# EAGLE design h-bridge (EAGLE 4.16)
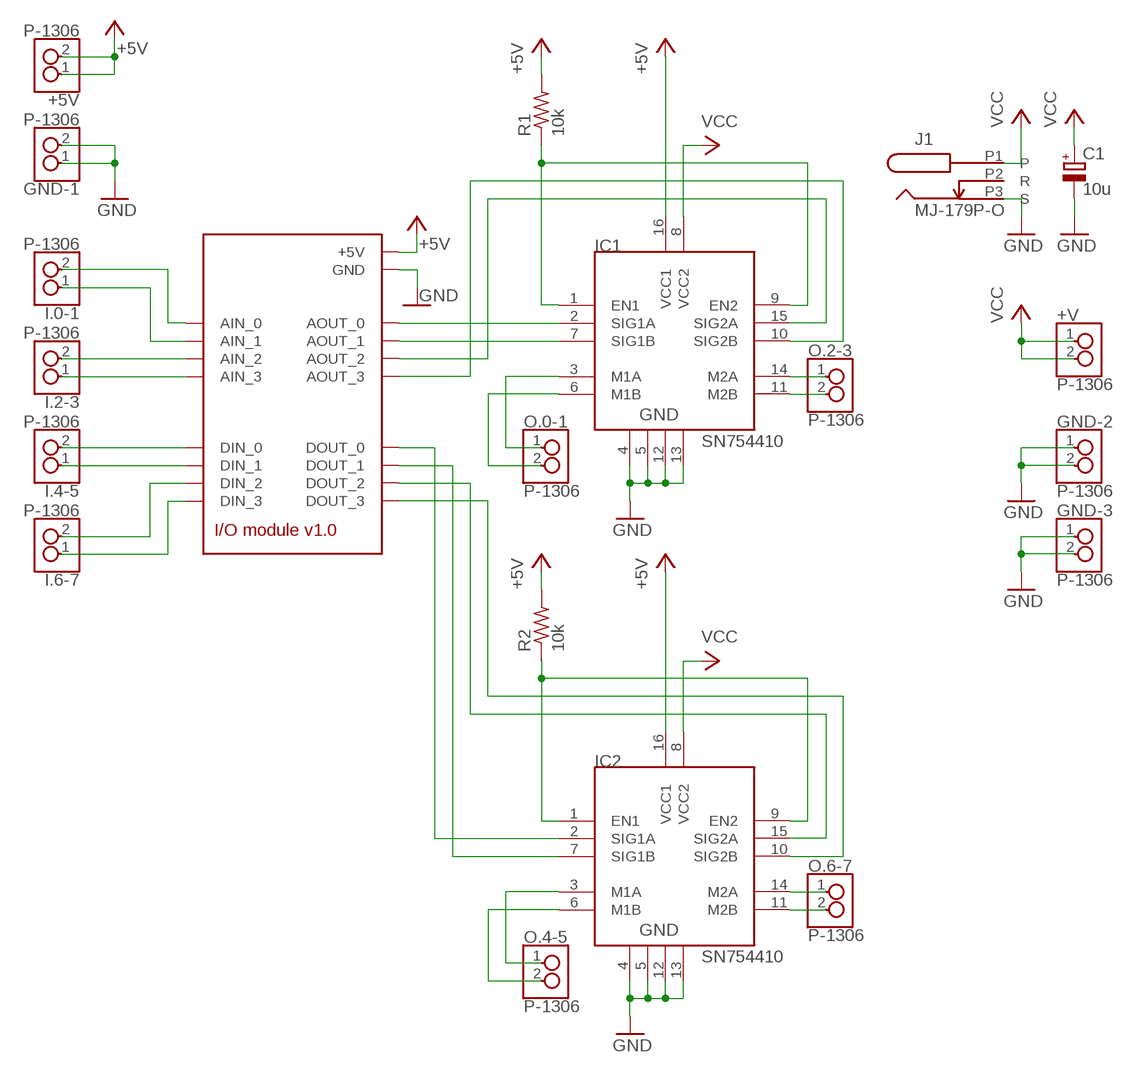
[diagram p0: schematic, sheet 1]

## Parts
+5V  P-1306  [P-1306]
+V  P-1306  [P-1306]
C1  10u  CPOL-EUE2.5-5  [E2,5-5]
GND-1  P-1306  [P-1306]
GND-2  P-1306  [P-1306]
GND-3  P-1306  [P-1306]
I.0-1  P-1306  [P-1306]
I.2-3  P-1306  [P-1306]
I.4-5  P-1306  [P-1306]
I.6-7  P-1306  [P-1306]
IC1  SN754410  [DIP16]
IC2  SN754410  [DIP16]
J1  MJ-179P-O  [MJ-179P-OLIMEX]
MODULE1  I/O_MODULE_V1.0  [I/O_MODULE_V1.0]
O.0-1  P-1306  [P-1306]
O.2-3  P-1306  [P-1306]
O.4-5  P-1306  [P-1306]
O.6-7  P-1306  [P-1306]
R1  10k  R-US_0204/5  [0204/5]
R2  10k  R-US_0204/5  [0204/5]

## Nets
+5V: +5V.1 +5V.2 IC1.16(VCC1) IC2.16(VCC1) MODULE1.+5V R1.2 R2.2
GND: C1.- GND-1.1 GND-1.2 GND-2.1 GND-2.2 GND-3.1 GND-3.2 IC1.4 IC1.5 IC1.12 IC1.13 IC2.4 IC2.5 IC2.12 IC2.13 J1.P3(S) MODULE1.GND
N$1: IC1.2(SIG1A) MODULE1.AOUT_0
N$2: IC1.7(SIG1B) MODULE1.AOUT_1
N$3: IC1.15(SIG2A) MODULE1.AOUT_2
N$4: IC1.10(SIG2B) MODULE1.AOUT_3
N$5: IC1.1(EN1) IC1.9(EN2) R1.1
N$6: I.0-1.2 MODULE1.AIN_0
N$7: IC2.2(SIG1A) MODULE1.DOUT_0
N$8: IC2.7(SIG1B) MODULE1.DOUT_1
N$9: IC2.15(SIG2A) MODULE1.DOUT_2
N$10: IC2.10(SIG2B) MODULE1.DOUT_3
N$11: IC2.1(EN1) IC2.9(EN2) R2.1
N$12: I.0-1.1 MODULE1.AIN_1
N$13: IC1.3(M1A) O.0-1.1
N$14: IC1.6(M1B) O.0-1.2
N$15: I.2-3.2 MODULE1.AIN_2
N$16: IC1.11(M2B) O.2-3.2
N$17: IC2.14(M2A) O.6-7.1
N$18: IC2.11(M2B) O.6-7.2
N$19: IC2.3(M1A) O.4-5.1
N$20: IC2.6(M1B) O.4-5.2
N$21: I.2-3.1 MODULE1.AIN_3
N$22: I.4-5.2 MODULE1.DIN_0
N$23: I.4-5.1 MODULE1.DIN_1
N$24: I.6-7.2 MODULE1.DIN_2
N$25: I.6-7.1 MODULE1.DIN_3
O.2-3: IC1.14(M2A) O.2-3.1
VCC: +V.1 +V.2 C1.+ IC1.8(VCC2) IC2.8(VCC2) J1.P1(P)
Unconnected: J1.P2(R)

## Library data of the parts
+5V +V GND-1-GND-3 I.0-1 I.2-3 I.4-5 I.6-7 O.0-1 O.2-3 O.4-5 O.6-7 = akizuki_terminal-block:P-1306
C1 = rcl:CPOL-EU: POLARIZED CAPACITOR, European symbol
IC1 IC2 = HBridge:SN754410: Quadruple half-H driver
J1 = marushin:MJ-179P-
MODULE1 = gainer:I/O_MODULE_V1.0
R1 R2 = rcl:R-US_: RESISTOR, American symbol

## Board
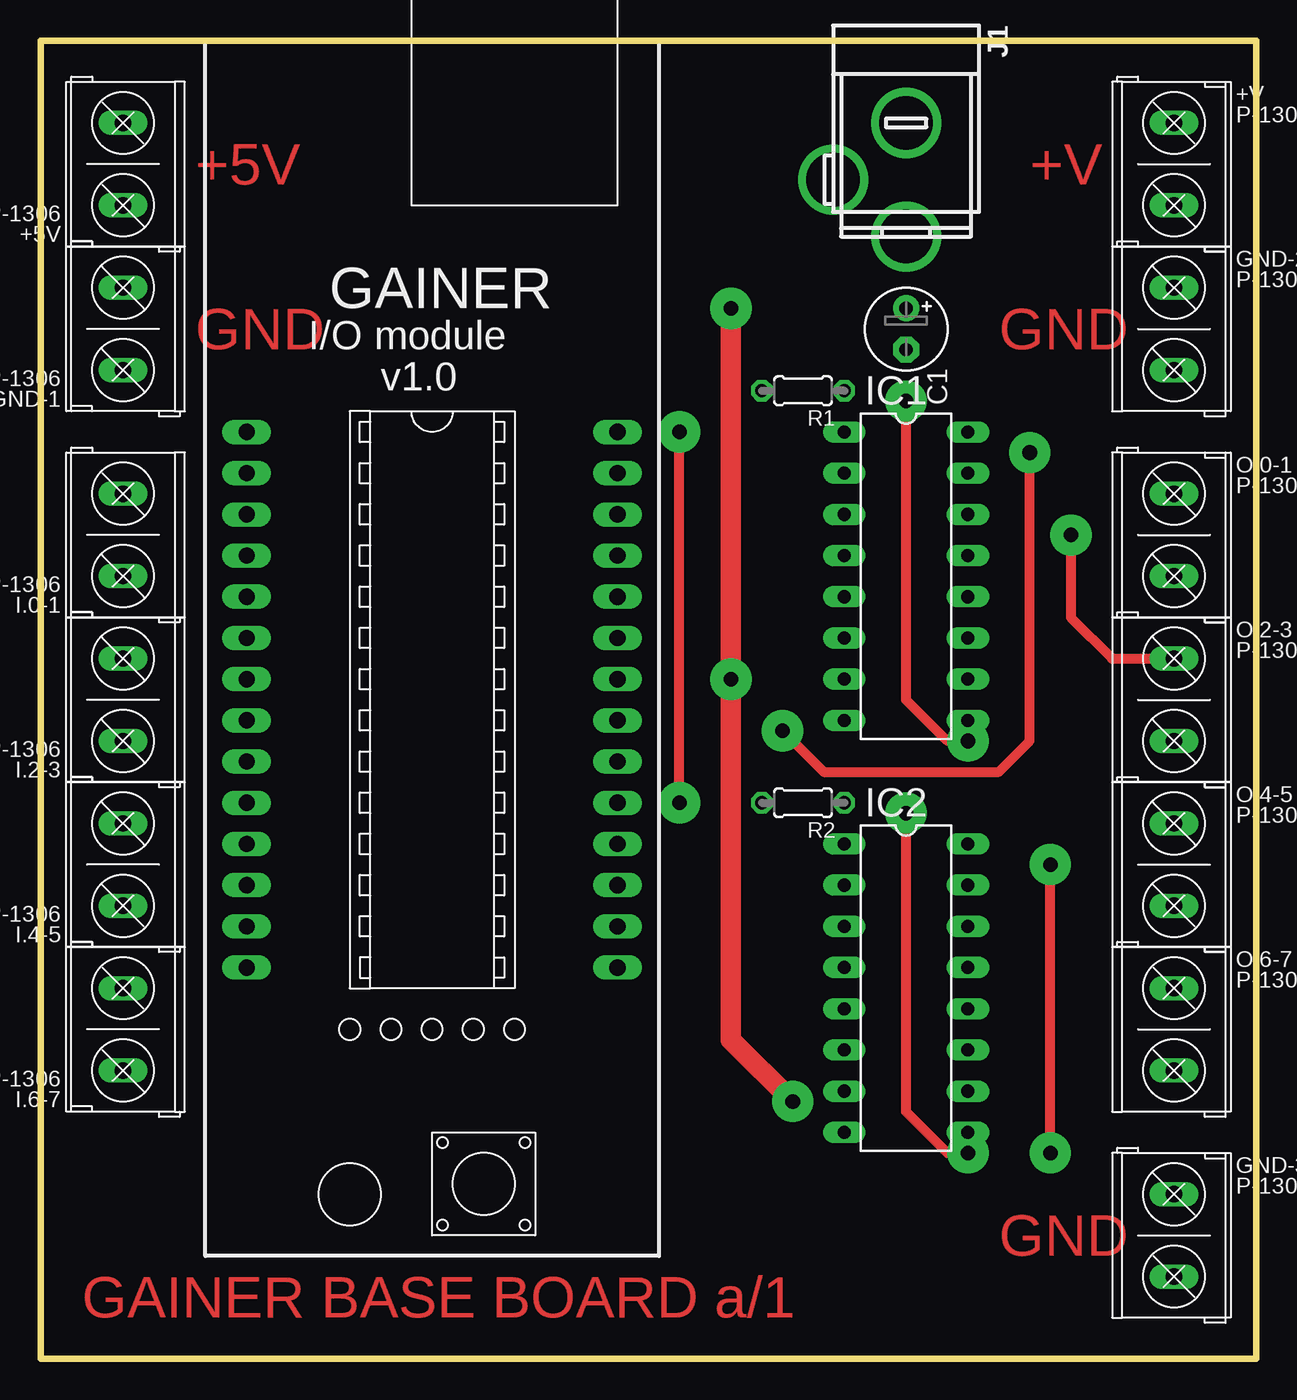
[diagram p1: board, top side]
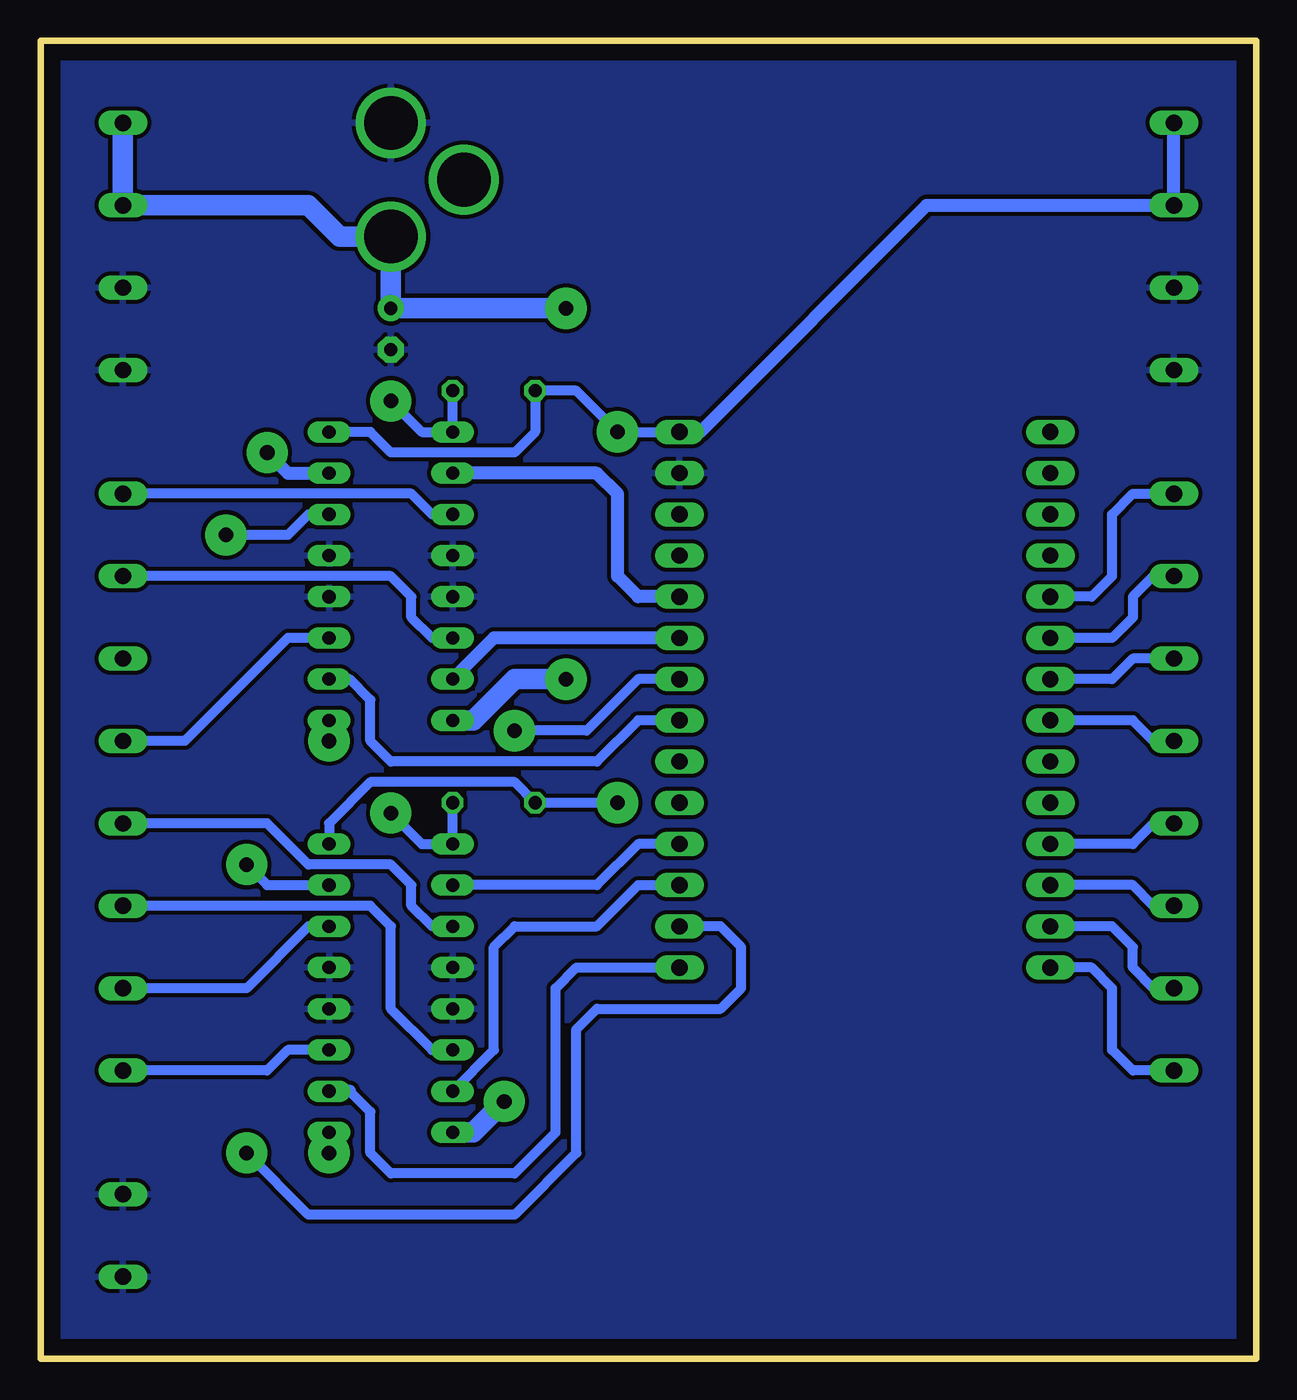
[diagram p2: board, bottom side, seen from below]

Size 74.93 x 81.28 mm. Coordinates in mm from the lower left corner, seen from the top.
Outline: 0,0 0,81.28 74.93,81.28 74.93,0 0,0
Copper layers (1*16): Top 0.035mm / dielectric 1.5mm / Bottom 0.035mm
Design rules "10mils": minimum track width 10mil, minimum drill 24mil, track to track 10mil, track to pad 10mil, pad to pad 10mil, via to via 10mil, smd to smd 10mil, copper to edge 40mil, drill to drill 10mil, minimum pad ring 10mil, minimum via ring 8mil, stop-mask expansion 0mil, vias tented up to drill 0mil, thermal gap 10mil

### Footprints (pad centres in the part's own frame; a part is rotated, then mirrored left to right if it is on the bottom)
P-1306 = drill 1 long: 1 0,2.54; 2 0,-2.54
E2,5-5 = drill 0.813 pad 1.6 round: + -1.27,0 | drill 0.813 pad 1.6 octagon: - 1.27,0
DIP16 = drill 0.813 long: 1 -10.16,-3.81; 2 -7.62,-3.81; 3 -5.08,-3.81; 4 -2.54,-3.81; 5 0,-3.81; 6 2.54,-3.81; 7 5.08,-3.81; 8 7.62,-3.81; 9 7.62,3.81; 10 5.08,3.81; 11 2.54,3.81; 12 0,3.81; 13 -2.54,3.81; 14 -5.08,3.81; 15 -7.62,3.81; 16 -10.16,3.81
MJ-179P-OLIMEX = drill 3.302 round: P1 3.19,1.27; P2 -0.31,-3.23; P3 -3.81,1.27
I/O_MODULE_V1.0 = drill 1 long: +5V 11.43,10.16; AIN_0 -11.43,0; AIN_1 -11.43,-2.54; AIN_2 -11.43,-5.08; AIN_3 -11.43,-7.62; AOUT_0 11.43,0; AOUT_1 11.43,-2.54; AOUT_2 11.43,-5.08; AOUT_3 11.43,-7.62; DIN_0 -11.43,-15.24; DIN_1 -11.43,-17.78; DIN_2 -11.43,-20.32; DIN_3 -11.43,-22.86; DOUT_0 11.43,-15.24; DOUT_1 11.43,-17.78; DOUT_2 11.43,-20.32; DOUT_3 11.43,-22.86; GND 11.43,7.62; P$1 -11.43,10.16; P$2 -11.43,7.62; P$3 -11.43,5.08; P$4 -11.43,2.54; P$5 -11.43,-10.16; P$6 -11.43,-12.7; P$7 11.43,5.08; P$8 11.43,2.54; P$9 11.43,-10.16; P$10 11.43,-12.7
0204/5 = drill 0.813 octagon: 1 -2.54,0; 2 2.54,0

### Placement (x,y rotation side)
+5V  5.08,73.66 180 top
+V  69.85,73.66 0 top
C1  53.34,63.5 270 top
GND-1  5.08,63.5 180 top
GND-2  69.85,63.5 0 top
GND-3  69.85,7.62 0 top
I.0-1  5.08,50.8 180 top
I.2-3  5.08,40.64 180 top
I.4-5  5.08,30.48 180 top
I.6-7  5.08,20.32 180 top
IC1  53.34,46.99 270 top
IC2  53.34,21.59 270 top
J1  52.07,72.39 270 top
MODULE1  24.13,46.99 0 top
O.0-1  69.85,50.8 0 top
O.2-3  69.85,40.64 0 top
O.4-5  69.85,30.48 0 top
O.6-7  69.85,20.32 0 top
R1  46.99,59.69 180 top
R2  46.99,34.29 180 top

### Tracks (layer width: path | path; a pad name or v marks a point on that pad's centre or on a via)
+5V  (via drill 0.9 pad 2.54)
  Top 0.61: v39.37,34.29 v39.37,57.15
  Bottom 0.61: v39.37,57.15 MODULE1.+5V v39.37,57.15 | v39.37,57.15 41.91,59.69 R1.2 44.45,57.15 45.72,55.88 53.34,55.88 54.61,57.15 IC1.16 | v39.37,34.29 R2.2 45.72,35.56 54.61,35.56 57.15,33.02 IC2.16
  Bottom 0.813: MODULE1.+5V 34.29,57.15 20.32,71.12 +5V.1 +5V.2
GND
  pour Bottom: -1.27,82.55 76.2,82.55 76.2,-1.27 -1.27,-1.27
N$1
  Bottom 0.813: MODULE1.AOUT_0 38.1,46.99 39.37,48.26 39.37,53.34 40.64,54.61 IC1.2
N$2
  Bottom 0.813: IC1.7 46.99,44.45 MODULE1.AOUT_1
N$3  (via drill 0.9 pad 2.54)
  Top 0.61: v60.96,55.88 60.96,38.1 59.05,36.2 48.26,36.2 v45.72,38.73
  Bottom 0.61: v45.72,38.73 41.27,38.73 38.1,41.91 MODULE1.AOUT_2
  Bottom 0.813: IC1.15 59.69,54.61 v60.96,55.88
N$4
  Bottom 0.61: MODULE1.AOUT_3 38.1,39.37 40.64,36.83 53.34,36.83 54.61,38.1 54.61,40.64 55.88,41.91 IC1.10
N$5  (via drill 0.9 pad 2.54)
  Top 0.61: v57.15,38.1 55.88,38.1 53.34,40.64 v53.34,59.05
  Bottom 0.61: v57.15,38.1 IC1.9 | v53.34,59.05 51.44,57.15 IC1.1 R1.1
N$6
  Bottom 0.61: MODULE1.AIN_0 10.16,46.99 8.89,48.26 8.89,52.07 7.62,53.34 I.0-1.2
N$7
  Bottom 0.61: MODULE1.DOUT_0 38.1,31.75 40.64,29.21 IC2.2
N$8
  Bottom 0.61: MODULE1.DOUT_1 38.1,29.21 40.64,26.67 45.72,26.67 46.99,25.4 46.99,19.05 IC2.7
N$9  (via drill 0.9 pad 2.54)
  Top 0.61: v62.23,12.7 v62.23,30.48
  Bottom 0.61: MODULE1.DOUT_2 33.02,26.67 31.75,25.4 31.75,22.86 33.02,21.59 40.64,21.59 41.91,20.32 41.91,12.7 45.72,8.89 58.42,8.89 v62.23,12.7 | IC2.15 60.96,29.21 v62.23,30.48
N$10
  Bottom 0.61: MODULE1.DOUT_3 41.91,24.13 43.18,22.86 43.18,13.97 45.72,11.43 53.34,11.43 54.61,12.7 54.61,15.24 55.88,16.51
  Bottom 0.813: 55.88,16.51 IC2.10
N$11  (via drill 0.9 pad 2.54)
  Top 0.61: v57.15,12.7 55.88,12.7 53.34,15.24 v53.34,33.66
  Bottom 0.61: v57.15,12.7 IC2.9 | R2.1 IC2.1 51.44,31.75 v53.34,33.66
N$12
  Bottom 0.61: I.0-1.1 6.35,48.26 7.62,46.99 7.62,45.72 8.89,44.45 MODULE1.AIN_1
N$13
  Bottom 0.61: IC1.3 50.8,52.07 52.07,53.34 O.0-1.1
N$14
  Bottom 0.61: IC1.6 50.8,44.45 52.07,45.72 52.07,46.99 53.34,48.26 O.0-1.2
N$15
  Bottom 0.61: I.2-3.2 7.62,43.18 8.89,41.91 MODULE1.AIN_2
N$16
  Bottom 0.61: IC1.11 59.69,44.45 66.04,38.1 O.2-3.2
N$17
  Bottom 0.61: IC2.14 58.42,26.67 62.23,22.86 O.6-7.1
N$18
  Bottom 0.61: IC2.11 59.69,19.05 60.96,17.78 O.6-7.2
N$19
  Bottom 0.61: IC2.3 50.8,26.67 52.07,27.94 52.07,29.21 53.34,30.48 58.42,30.48 60.96,33.02 O.4-5.1
N$20
  Bottom 0.61: IC2.6 50.8,19.05 53.34,21.59 53.34,26.67 54.61,27.94 O.4-5.2
N$21
  Bottom 0.61: I.2-3.1 6.35,38.1 7.62,39.37 MODULE1.AIN_3
N$22
  Bottom 0.61: I.4-5.2 6.35,33.02 7.62,31.75 MODULE1.DIN_0
N$23
  Bottom 0.61: I.4-5.1 6.35,27.94 7.62,29.21 MODULE1.DIN_1
N$24
  Bottom 0.61: I.6-7.2 6.35,22.86 7.62,24.13 7.62,25.4 8.89,26.67 MODULE1.DIN_2
N$25
  Bottom 0.61: I.6-7.1 7.62,17.78 8.89,19.05 8.89,22.86 10.16,24.13 MODULE1.DIN_3
O.2-3  (via drill 0.9 pad 2.54)
  Top 0.61: v63.5,50.8 63.5,45.72 66.04,43.18 O.2-3.1
  Bottom 0.61: IC1.14 58.42,52.07 59.69,50.8 v63.5,50.8
VCC  (via drill 0.9 pad 2.54)
  Top 1.27: v42.55,64.77 v42.55,41.91 42.55,38.73 | 42.55,38.73 42.55,38.1 | v46.35,15.88 42.55,19.68 42.55,38.73
  Bottom 1.27: v42.55,64.77 C1.+ J1.P1 56.5,69.2 58.42,71.12 +V.2 +V.1 | IC1.8 48.26,39.37 45.72,41.91 v42.55,41.91 | IC2.8 48.26,13.97 v46.35,15.88

### Text on the board
Top: +5V | +V | GND | GND | GND | GAINER BASE BOARD a/1